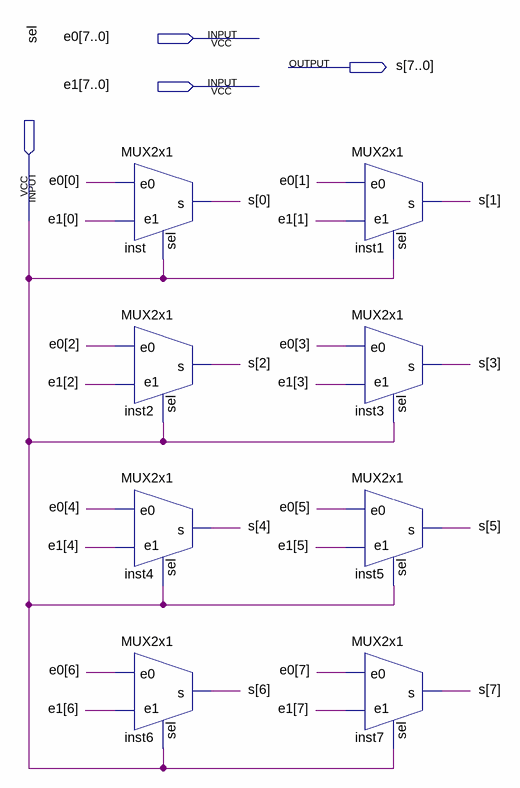
[diagram p0: schematic sheet]
// Quartus schematic MUX16x8.bdf as structural Verilog: 8 symbols, 4 pins
module MUX16x8 (
  input  [7:0] e0,
  input  [7:0] e1,
  input  sel,
  output [7:0] s
);

  MUX2x1 inst (.e0(e0[0]), .e1(e1[0]), .sel(sel), .s(s[0]));
  MUX2x1 inst2 (.e0(e0[2]), .e1(e1[2]), .sel(sel), .s(s[2]));
  MUX2x1 inst4 (.e0(e0[4]), .e1(e1[4]), .sel(sel), .s(s[4]));
  MUX2x1 inst6 (.e0(e0[6]), .e1(e1[6]), .sel(sel), .s(s[6]));
  MUX2x1 inst1 (.e0(e0[1]), .e1(e1[1]), .sel(sel), .s(s[1]));
  MUX2x1 inst3 (.e0(e0[3]), .e1(e1[3]), .sel(sel), .s(s[3]));
  MUX2x1 inst5 (.e0(e0[5]), .e1(e1[5]), .sel(sel), .s(s[5]));
  MUX2x1 inst7 (.e0(e0[7]), .e1(e1[7]), .sel(sel), .s(s[7]));
endmodule
